# Altium project marlin-9ghz-1x4.PrjPcb
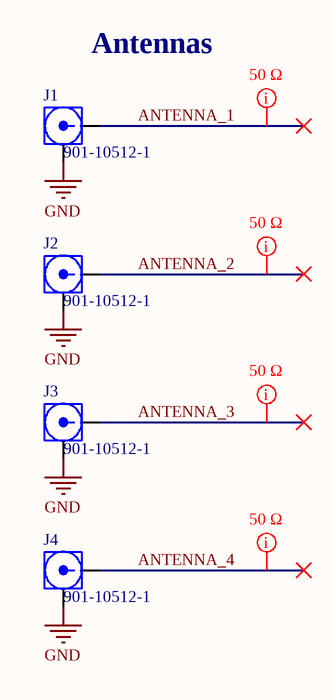
[diagram p0: MARLIN.SchDoc]
1 sheet, 4 parts. Net scope: global (net labels, ports and power ports of the same name join across sheets).
Board file: MARLIN.PcbDoc

## Sheet MARLIN.SchDoc
size Letter; DrawnBy: Titan Yuan; SheetNumber: 1; SheetTotal: 1

### Parts
J1  901-10512-1  [901-10512-1]
J2  901-10512-1  [901-10512-1]
J3  901-10512-1  [901-10512-1]
J4  901-10512-1  [901-10512-1]

### Nets
GND: J1.2 J2.2 J3.2 J4.2
ANTENNA_1: J1.1
ANTENNA_2: J2.1
ANTENNA_3: J3.1
ANTENNA_4: J4.1

### Layout directives
net class 50 Ω: ANTENNA_1, ANTENNA_2, ANTENNA_3, ANTENNA_4

### Notes on the sheet
- (near J1) Antennas

### Library data of the parts
J1-J4 = 901-10512-1: RF / Coaxial Connector, SMA Coaxial, Straight Flanged Jack, Solder, 50 ohm, Beryllium Copper; Manufacturer: Amphenol; Maximum Frequency: 26.5 GHz; Connector Type: SMA, Socket; Impedance: 50Ω; Clock Frequency: 26.5GHz; Voltage Rating: 170V; Manufacturer Part Number: 901-10512-1; Supplier: DigiKey; Supplier Part Number: ARF2501-ND; RoHS: Compliant; Category: RF / Coaxial Connectors; Stock: 96; Pricing: 1=11.3, 10=9.599, 25=8.9976, 50=8.568, 100=8.159, 300=7.55083, 500=7.28374, 1000=6.93654 (USD); Case/Package: SMA; Contact Material: Copper; Fastening Type: Threaded; Lifecycle Status: Production; Max Operating Temperature: 165°C; Min Operating Temperature: -65°C; Mounting Technology: Edge, Through Hole; Orientation: Straight; Termination: Solder; ComponentLink1URL: https://datasheet.octopart.com:443/901-10512-1-Amphenol-RF-datasheet-67291281.pdf?src-supplier=TME; ComponentLink1Description: https://datasheet.octopart.com:443/901-10512-1-Amphenol-RF-datasheet-67291281.pdf?src-supplier=TME; ComponentLink2URL: https://datasheet.octopart.com:443/901-10512-1-Amphenol-datasheet-151206439.pdf?src-supplier=IHS; ComponentLink2Description: https://datasheet.octopart.com:443/901-10512-1-Amphenol-datasheet-151206439.pdf?src-supplier=IHS; ComponentLink3URL: https://datasheet.octopart.com:443/901-10512-1-Amphenol-RF-datasheet-67291285.pdf?src-supplier=Newark; ComponentLink3Description: https://datasheet.octopart.com:443/901-10512-1-Amphenol-RF-datasheet-67291285.pdf?src-supplier=Newark; ComponentLink4URL: https://datasheet.octopart.com:443/901-10512-1-Amphenol-RF-datasheet-114836026.pdf?src-supplier=RS+(Formerly+Allied+Electronics); ComponentLink4Description: https://datasheet.octopart.com:443/901-10512-1-Amphenol-RF-datasheet-114836026.pdf?src-supplier=RS+(Formerly+Allied+Electronics); ComponentLink5URL: https://datasheet.octopart.com:443/901-10512-1-Amphenol-RF-datasheet-177020667.pdf?src-supplier=Burklin+Elektronik; ComponentLink5Description: https://datasheet.octopart.com:443/901-10512-1-Amphenol-RF-datasheet-177020667.pdf?src-supplier=Burklin+Elektronik; ComponentLink6URL: https://datasheet.octopart.com:443/901-10512-1-Amphenol-RF-datasheet-181430700.pdf?src-supplier=JRH+Electronics; ComponentLink6Description: https://datasheet.octopart.com:443/901-10512-1-Amphenol-RF-datasheet-181430700.pdf?src-supplier=JRH+Electronics